# Altium schematic sheet wifi_bluetooth.SchDoc
size A4
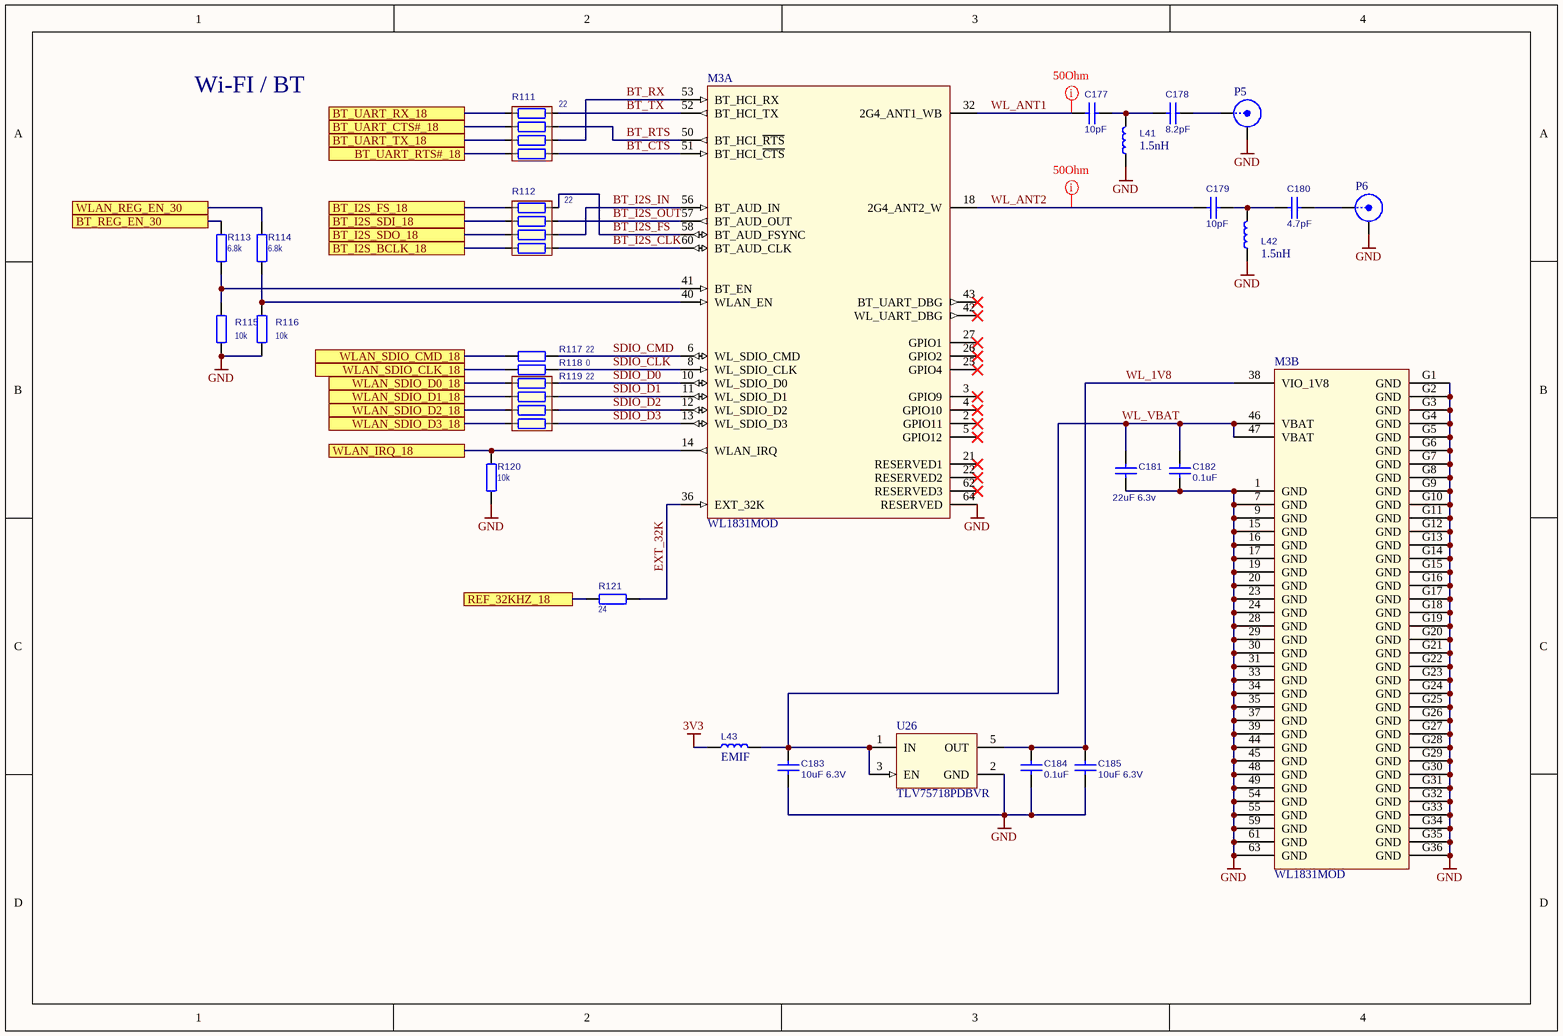
[diagram p0: wifi_bluetooth.SchDoc]

## Parts
C177  value 10pF  [C0603]  (hidden comment: CL10C100JB8NNNC)
C178  value 8.2pF  [C0603]  (hidden comment: CL10C8R2CB8NNNC)
C179  value 10pF  [C0603]  (hidden comment: CL10C100JB8NNNC)
C180  value 4.7pF  [C0603]  (hidden comment: CC0603CRNPO9BN4R7)
C181  value 22uF 6.3v  [C0805]  (hidden comment: CL21A226MQQNNNE)
C182  value 0.1uF  [C0603]  (hidden comment: C1608X7R1H104K080AA)
C183  value 10uF 6.3V  [C0603]  (hidden comment: CC0603MRX5R5BB106)
C184  value 0.1uF  [C0603]  (hidden comment: C1608X7R1H104K080AA)
C185  value 10uF 6.3V  [C0603]  (hidden comment: CC0603MRX5R5BB106)
L41  value 1.5nH  [IND0603]  (hidden comment: CLH1608T-1N5S-N)
L42  value 1.5nH  [IND0603]  (hidden comment: CLH1608T-1N5S-N)
L43  value EMIF  [IND0805]  (hidden comment: BLM21PG221SN1D)
M3  WL1831MOD  [E-13.4X13.3-N100_0.75-TOP]  (parts A,B of 2)
P5  I-PEX  [I-PEX]  (value not drawn)
P6  I-PEX  [I-PEX]  (value not drawn)
R111  value 22  [R0804X4]  (hidden comment: TC124-JR-0722RL)
R112  value 22  [R0804X4]  (hidden comment: TC124-JR-0722RL)
R113  6.8k  [R0603]
R114  6.8k  [R0603]
R115  10k  [R0603]
R116  10k  [R0603]
R117  22  [R0603]
R118  0  [R0603]
R119  value 22  [R0804X4]  (hidden comment: TC124-JR-0722RL)
R120  10k  [R0603]
R121  24  [R0603]
U26  TLV75718PDBVR  [SOT-23-5]

## Ports
BT_I2S_BCLK_18, BT_I2S_FS_18, BT_I2S_SDI_18, BT_I2S_SDO_18, BT_REG_EN_30, BT_UART_CTS#_18, BT_UART_RTS#_18, BT_UART_RX_18, BT_UART_TX_18, REF_32KHZ_18, WLAN_IRQ_18, WLAN_REG_EN_30, WLAN_SDIO_CLK_18, WLAN_SDIO_CMD_18, WLAN_SDIO_D0_18, WLAN_SDIO_D1_18, WLAN_SDIO_D2_18, WLAN_SDIO_D3_18

## Nets
3V3: L43.2
GND: C181.1 C182.1 C183.2 C184.2 C185.2 L41.1 L42.1 M3.1(GND) M3.7(GND) M3.9(GND) M3.15(GND) M3.16(GND) M3.17(GND) M3.19(GND) M3.20(GND) M3.23(GND) M3.24(GND) M3.28(GND) M3.29(GND) M3.30(GND) M3.31(GND) M3.33(GND) M3.34(GND) M3.35(GND) M3.37(GND) M3.39(GND) M3.44(GND) M3.45(GND) M3.48(GND) M3.49(GND) M3.54(GND) M3.55(GND) M3.59(GND) M3.61(GND) M3.63(GND) M3.64(RESERVED) M3.G1(GND) M3.G2(GND) M3.G3(GND) M3.G4(GND) M3.G5(GND) M3.G6(GND) M3.G7(GND) M3.G8(GND) M3.G9(GND) M3.G10(GND) M3.G11(GND) M3.G12(GND) M3.G13(GND) M3.G14(GND) M3.G15(GND) M3.G16(GND) M3.G17(GND) M3.G18(GND) M3.G19(GND) M3.G20(GND) M3.G21(GND) M3.G22(GND) M3.G23(GND) M3.G24(GND) M3.G25(GND) M3.G26(GND) M3.G27(GND) M3.G28(GND) M3.G29(GND) M3.G30(GND) M3.G31(GND) M3.G32(GND) M3.G33(GND) M3.G34(GND) M3.G35(GND) M3.G36(GND) P5.2(Y) P6.2(Y) R115.2 R116.1 R120.1 U26.2(GND)
BT_CTS: M3.51(BT_HCI_~{CTS}) R111.8
BT_I2S_BCLK_18: R112.7 ; port BT_I2S_BCLK_18
BT_I2S_CLK: M3.60(BT_AUD_CLK) R112.8
BT_I2S_FS: M3.58(BT_AUD_FSYNC) R112.2
BT_I2S_FS_18: R112.1 ; port BT_I2S_FS_18
BT_I2S_IN: M3.56(BT_AUD_IN) R112.6
BT_I2S_OUT: M3.57(BT_AUD_OUT) R112.4
BT_I2S_SDI_18: R112.3 ; port BT_I2S_SDI_18
BT_I2S_SDO_18: R112.5 ; port BT_I2S_SDO_18
BT_REG_EN_30: R113.1 ; port BT_REG_EN_30
BT_RTS: M3.50(BT_HCI_~{RTS}) R111.4
BT_RX: M3.53(BT_HCI_RX) R111.6
BT_TX: M3.52(BT_HCI_TX) R111.2
BT_UART_CTS#_18: R111.3 ; port BT_UART_CTS#_18
BT_UART_RTS#_18: R111.7 ; port BT_UART_RTS#_18
BT_UART_RX_18: R111.1 ; port BT_UART_RX_18
BT_UART_TX_18: R111.5 ; port BT_UART_TX_18
EXT_32K: M3.36(EXT_32K) R121.2
REF_32KHZ_18: R121.1 ; port REF_32KHZ_18
SDIO_CLK: M3.8(WL_SDIO_CLK) R118.1
SDIO_CMD: M3.6(WL_SDIO_CMD) R117.1
SDIO_D0: M3.10(WL_SDIO_D0) R119.1
SDIO_D1: M3.11(WL_SDIO_D1) R119.3
SDIO_D2: M3.12(WL_SDIO_D2) R119.5
SDIO_D3: M3.13(WL_SDIO_D3) R119.7
WL_1V8: C184.1 C185.1 M3.38(VIO_1V8) U26.5(OUT)
WL_ANT1: C177.1 M3.32(2G4_ANT1_WB)
WL_ANT2: C179.1 M3.18(2G4_ANT2_W)
WL_VBAT: C181.2 C182.2 C183.1 L43.1 M3.46(VBAT) M3.47(VBAT) U26.1(IN) U26.3(EN)
WLAN_IRQ_18: M3.14(WLAN_IRQ) R120.2 ; port WLAN_IRQ_18
WLAN_REG_EN_30: R114.1 ; port WLAN_REG_EN_30
WLAN_SDIO_CLK_18: R118.2 ; port WLAN_SDIO_CLK_18
WLAN_SDIO_CMD_18: R117.2 ; port WLAN_SDIO_CMD_18
WLAN_SDIO_D0_18: R119.2 ; port WLAN_SDIO_D0_18
WLAN_SDIO_D1_18: R119.4 ; port WLAN_SDIO_D1_18
WLAN_SDIO_D2_18: R119.6 ; port WLAN_SDIO_D2_18
WLAN_SDIO_D3_18: R119.8 ; port WLAN_SDIO_D3_18
NetC177_2: C177.2 C178.1 L41.2
NetC178_2: C178.2 P5.1(X)
NetC179_2: C179.2 C180.1 L42.2
NetC180_2: C180.2 P6.1(X)
NetM3_40: M3.40(WLAN_EN) R114.2 R116.2
NetM3_41: M3.41(BT_EN) R113.2 R115.1

Not connected (* = marked no-connect by the designer): M3 2(GPIO11)* 3(GPIO9)* 4(GPIO10)* 5(GPIO12)* 21(RESERVED1)* 22(RESERVED2)* 25(GPIO4)* 26(GPIO2)* 27(GPIO1)* 42(WL_UART_DBG)* 43(BT_UART_DBG)* 62(RESERVED3)*

## Layout directives
rule Undefined: WL_ANT1, WL_ANT2

## Notes on the sheet
- Wi-FI / BT

## Library data of the parts
C177-C185 = CAP_NPOL
L41-L43 = IND_WO_IRON
M3 = WL18xxMOD
P5 P6 = BNC: LatestRevisionDate: 17-Jul-2002; LatestRevisionNote: Re-released for DXP Platform.; Publisher: Altium Limited
R111 R112 R119 = ARRAY
R113-R118 R120 R121 = RESISTOR: RES
  R113 R114: Value: 6.8k
  R115 R116 R120: Value: 10k
  R117: Value: 22
  R118: Value: 0
  R121: Value: 24
U26 = TLV733P: Capacitor-Free, 300-mA, Low-Dropout Regulator with Foldback Current Limit for Portable Devices; value: TLV733P